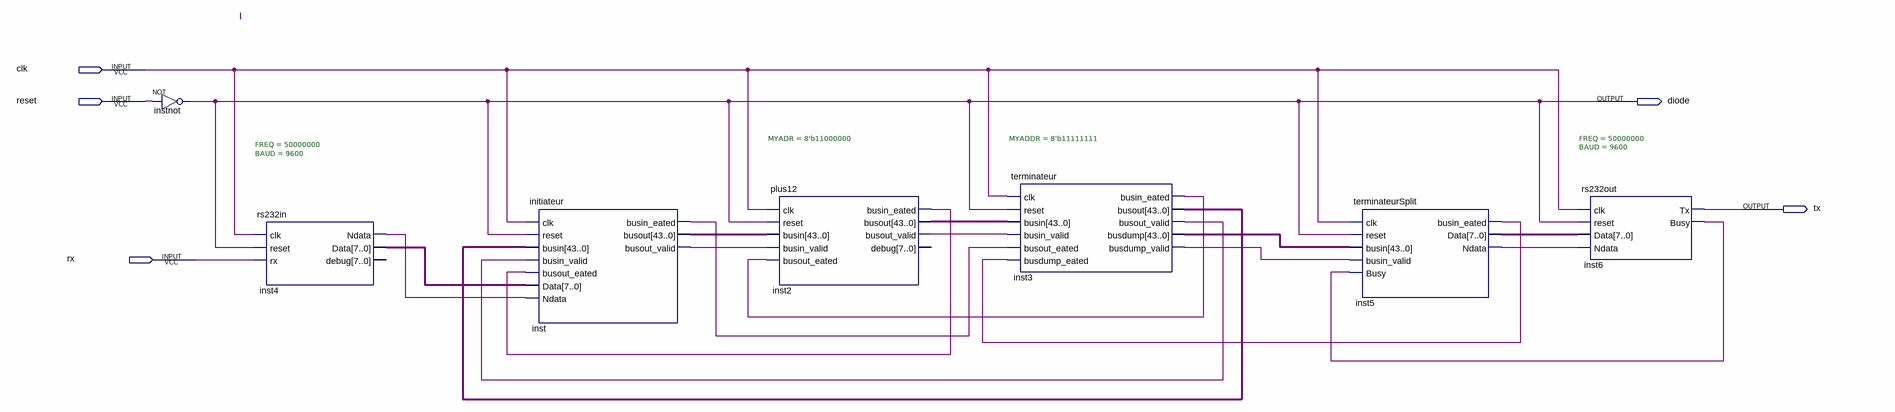
[diagram p0: schematic sheet]
// Quartus schematic bus_ia.bdf as structural Verilog: 7 symbols, 5 pins
module bus_ia (
  input  clk,
  input  reset,
  input  rx,
  output diode,
  output tx
);

  wire inst2_busin_eated, inst2_busout_valid, inst3_busdump_valid, inst3_busin_eated, inst3_busout_valid,
       inst4_ndata, inst5_busin_eated, inst5_ndata, inst6_busy, inst_busin_eated, inst_busout_valid;
  wire [7:0] inst4_data, inst5_data;
  wire [43:0] inst2_busout, inst3_busdump, inst3_busout, inst_busout;

  not instnot (diode, reset);
  rs232in #(.FREQ(50000000), .BAUD(9600)) inst4 (
    .clk(clk), .reset(diode), .rx(rx), .Ndata(inst4_ndata), .Data(inst4_data));  // open: debug
  initiateur inst (
    .clk(clk), .reset(diode), .busin(inst3_busout), .busin_valid(inst3_busout_valid),
    .busout_eated(inst2_busin_eated), .Data(inst4_data), .Ndata(inst4_ndata), .busin_eated(inst_busin_eated),
    .busout(inst_busout), .busout_valid(inst_busout_valid));
  plus12 #(.MYADR(8'b11000000)) inst2 (
    .clk(clk), .reset(diode), .busin(inst_busout), .busin_valid(inst_busout_valid),
    .busout_eated(inst3_busin_eated), .busin_eated(inst2_busin_eated), .busout(inst2_busout),
    .busout_valid(inst2_busout_valid));  // open: debug
  terminateur #(.MYADDR(8'b11111111)) inst3 (
    .clk(clk), .reset(diode), .busin(inst2_busout), .busin_valid(inst2_busout_valid),
    .busout_eated(inst_busin_eated), .busdump_eated(inst5_busin_eated), .busin_eated(inst3_busin_eated),
    .busout(inst3_busout), .busout_valid(inst3_busout_valid), .busdump(inst3_busdump),
    .busdump_valid(inst3_busdump_valid));
  terminateurSplit inst5 (
    .clk(clk), .reset(diode), .busin(inst3_busdump), .busin_valid(inst3_busdump_valid), .Busy(inst6_busy),
    .busin_eated(inst5_busin_eated), .Data(inst5_data), .Ndata(inst5_ndata));
  rs232out #(.FREQ(50000000), .BAUD(9600)) inst6 (
    .clk(clk), .reset(diode), .Data(inst5_data), .Ndata(inst5_ndata), .Tx(tx), .Busy(inst6_busy));
endmodule
